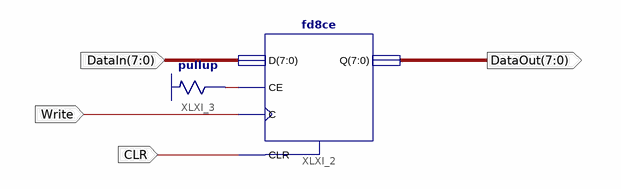
[diagram p0: schematic sheet 1]
// Xilinx ISE schematic RegisterGeneric.sch (spartan3e) as structural Verilog: 2 symbols, 4 ports
module RegisterGeneric (
  input  [7:0] DataIn,
  input  Write,
  input  CLR,
  output [7:0] DataOut
);

  wire XLXN_4;

  fd8ce XLXI_2 (.C(Write), .CE(XLXN_4), .CLR(CLR), .D(DataIn), .Q(DataOut));
  \pullup  XLXI_3 (.O(XLXN_4));
endmodule
